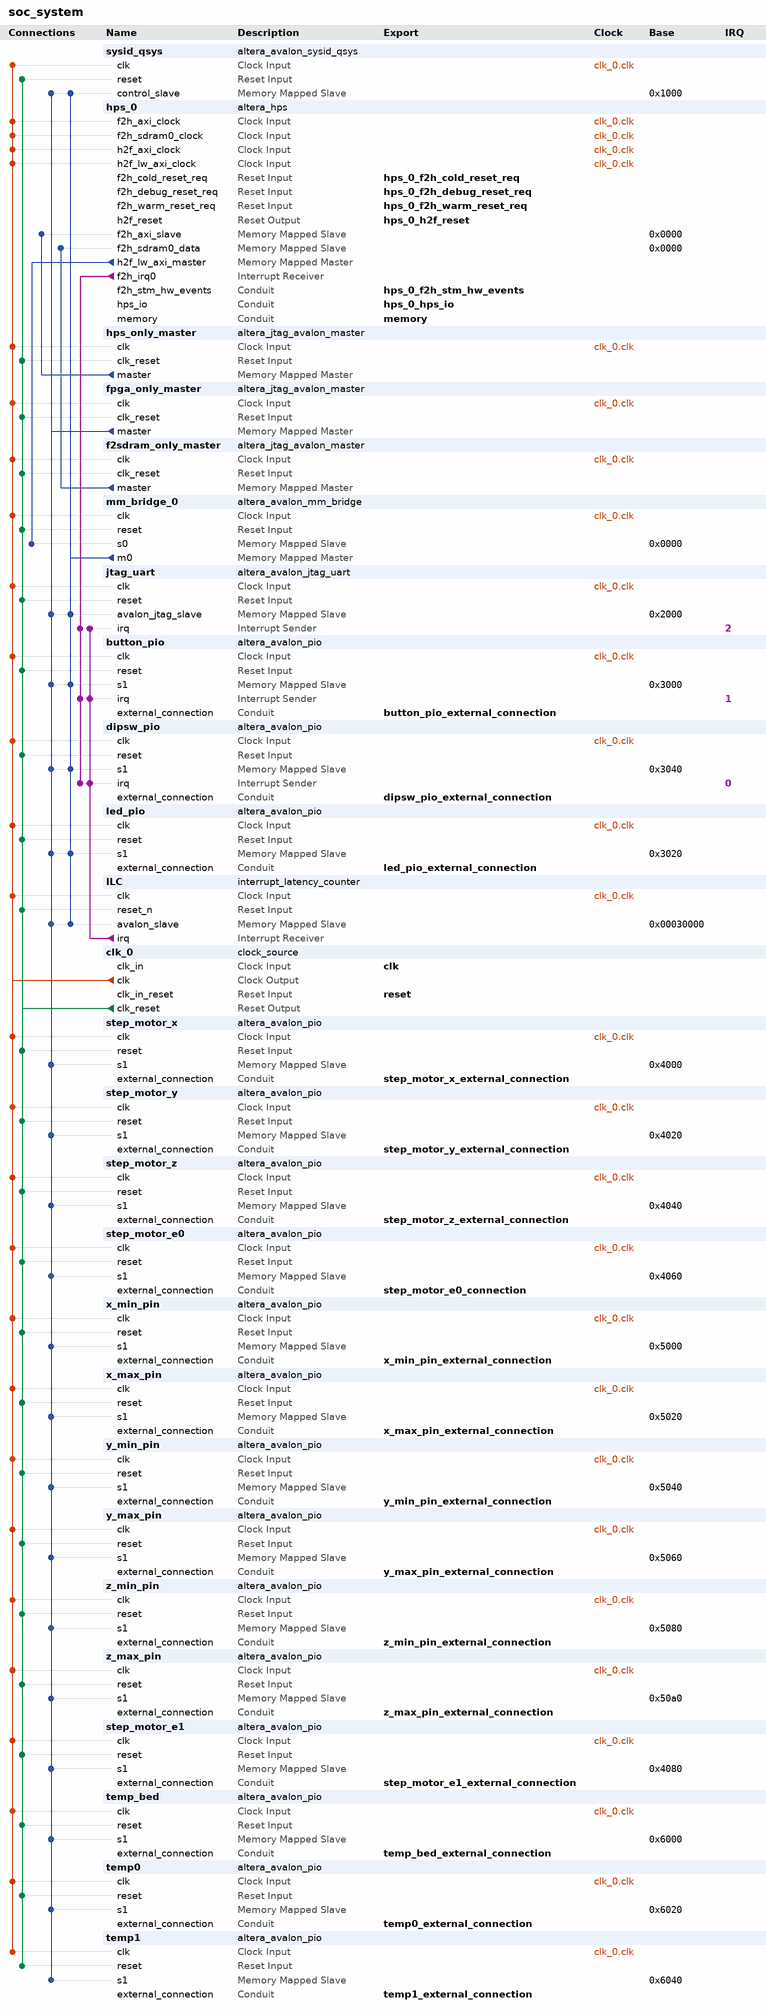
[diagram p0: system contents]
# Platform Designer (Qsys) system soc_system, Cyclone V 5CSEBA6U23I7
# Parameters at their usual value, and those the tool derives, are not listed.
package require -exact qsys 18.1
create_system soc_system
set_project_property DEVICE_FAMILY {Cyclone V}
set_project_property DEVICE 5CSEBA6U23I7

add_instance sysid_qsys altera_avalon_sysid_qsys 18.1
set_instance_parameter_value sysid_qsys id -60670

add_instance hps_0 altera_hps 18.1
set_instance_parameter_value hps_0 EMAC1_Mode RGMII
set_instance_parameter_value hps_0 EMAC1_PinMuxing {HPS I/O Set 0}
set_instance_parameter_value hps_0 F2SCLK_COLDRST_Enable true
set_instance_parameter_value hps_0 F2SCLK_DBGRST_Enable true
set_instance_parameter_value hps_0 F2SCLK_WARMRST_Enable true
set_instance_parameter_value hps_0 F2SDRAM_Type {Avalon-MM Bidirectional}
set_instance_parameter_value hps_0 F2SDRAM_Width 256
set_instance_parameter_value hps_0 F2SINTERRUPT_Enable true
set_instance_parameter_value hps_0 F2S_Width 2
set_instance_parameter_value hps_0 FPGA_PERIPHERAL_OUTPUT_CLOCK_FREQ_EMAC0_GTX_CLK 100
set_instance_parameter_value hps_0 FPGA_PERIPHERAL_OUTPUT_CLOCK_FREQ_EMAC0_MD_CLK 100.0
set_instance_parameter_value hps_0 FPGA_PERIPHERAL_OUTPUT_CLOCK_FREQ_EMAC1_GTX_CLK 100
set_instance_parameter_value hps_0 FPGA_PERIPHERAL_OUTPUT_CLOCK_FREQ_EMAC1_MD_CLK 100.0
set_instance_parameter_value hps_0 HPS_PROTOCOL DDR3
set_instance_parameter_value hps_0 I2C0_Mode I2C
set_instance_parameter_value hps_0 I2C0_PinMuxing {HPS I/O Set 0}
set_instance_parameter_value hps_0 I2C1_Mode I2C
set_instance_parameter_value hps_0 I2C1_PinMuxing {HPS I/O Set 0}
set_instance_parameter_value hps_0 LWH2F_Enable true
set_instance_parameter_value hps_0 MEM_BANKADDR_WIDTH 3
set_instance_parameter_value hps_0 MEM_CLK_FREQ 400.0
set_instance_parameter_value hps_0 MEM_COL_ADDR_WIDTH 10
set_instance_parameter_value hps_0 MEM_DQ_WIDTH 32
set_instance_parameter_value hps_0 MEM_DRV_STR RZQ/6
set_instance_parameter_value hps_0 MEM_ROW_ADDR_WIDTH 15
set_instance_parameter_value hps_0 MEM_RTT_NOM RZQ/6
set_instance_parameter_value hps_0 MEM_RTT_WR {Dynamic ODT off}
set_instance_parameter_value hps_0 MEM_TCL 7
set_instance_parameter_value hps_0 MEM_TFAW_NS 37.5
set_instance_parameter_value hps_0 MEM_TRAS_NS 35.0
set_instance_parameter_value hps_0 MEM_TRCD_NS 13.75
set_instance_parameter_value hps_0 MEM_TRFC_NS 300.0
set_instance_parameter_value hps_0 MEM_TRP_NS 13.75
set_instance_parameter_value hps_0 MEM_VENDOR Other
set_instance_parameter_value hps_0 MEM_WTCL 7
set_instance_parameter_value hps_0 QSPI_Mode N/A
set_instance_parameter_value hps_0 QSPI_PinMuxing Unused
set_instance_parameter_value hps_0 REF_CLK_FREQ 25.0
set_instance_parameter_value hps_0 S2FCLK_USER2CLK 4
set_instance_parameter_value hps_0 S2F_Width 2
set_instance_parameter_value hps_0 SDIO_Mode {4-bit Data}
set_instance_parameter_value hps_0 SDIO_PinMuxing {HPS I/O Set 0}
set_instance_parameter_value hps_0 SPIM1_Mode {Single Slave Select}
set_instance_parameter_value hps_0 SPIM1_PinMuxing {HPS I/O Set 0}
set_instance_parameter_value hps_0 STM_Enable true
set_instance_parameter_value hps_0 TIMING_BOARD_AC_SKEW 0.02
set_instance_parameter_value hps_0 TIMING_BOARD_AC_TO_CK_SKEW 0.0
set_instance_parameter_value hps_0 TIMING_BOARD_DQ_TO_DQS_SKEW 0.0
set_instance_parameter_value hps_0 TIMING_BOARD_MAX_CK_DELAY 0.6
set_instance_parameter_value hps_0 TIMING_BOARD_MAX_DQS_DELAY 0.6
set_instance_parameter_value hps_0 TIMING_BOARD_SKEW_BETWEEN_DQS 0.02
set_instance_parameter_value hps_0 TIMING_BOARD_SKEW_CKDQS_DIMM_MAX 0.01
set_instance_parameter_value hps_0 TIMING_BOARD_SKEW_CKDQS_DIMM_MIN -0.01
set_instance_parameter_value hps_0 TIMING_BOARD_SKEW_WITHIN_DQS 0.02
set_instance_parameter_value hps_0 TIMING_TDH 125
set_instance_parameter_value hps_0 TIMING_TDQSCK 400
set_instance_parameter_value hps_0 TIMING_TDQSQ 120
set_instance_parameter_value hps_0 TIMING_TDS 50
set_instance_parameter_value hps_0 TIMING_TIH 250
set_instance_parameter_value hps_0 TIMING_TIS 175
set_instance_parameter_value hps_0 TIMING_TQSH 0.38
set_instance_parameter_value hps_0 UART0_Mode {No Flow Control}
set_instance_parameter_value hps_0 UART0_PinMuxing {HPS I/O Set 0}
set_instance_parameter_value hps_0 USB1_Mode SDR
set_instance_parameter_value hps_0 USB1_PinMuxing {HPS I/O Set 0}
set_instance_parameter_value hps_0 desired_cfg_clk_mhz 100.0
set_instance_parameter_value hps_0 desired_qspi_clk_mhz 370.0

add_instance hps_only_master altera_jtag_avalon_master 18.1

add_instance fpga_only_master altera_jtag_avalon_master 18.1

add_instance f2sdram_only_master altera_jtag_avalon_master 18.1

add_instance mm_bridge_0 altera_avalon_mm_bridge 18.1
set_instance_parameter_value mm_bridge_0 ADDRESS_UNITS SYMBOLS
set_instance_parameter_value mm_bridge_0 ADDRESS_WIDTH 10
set_instance_parameter_value mm_bridge_0 DATA_WIDTH 32
set_instance_parameter_value mm_bridge_0 MAX_PENDING_RESPONSES 4
set_instance_parameter_value mm_bridge_0 USE_AUTO_ADDRESS_WIDTH 1

add_instance jtag_uart altera_avalon_jtag_uart 18.1
set_instance_parameter_value jtag_uart allowMultipleConnections true
set_instance_parameter_value jtag_uart simInteractiveOptions INTERACTIVE_ASCII_OUTPUT

add_instance button_pio altera_avalon_pio 18.1
set_instance_parameter_value button_pio bitClearingEdgeCapReg true
set_instance_parameter_value button_pio captureEdge true
set_instance_parameter_value button_pio direction Input
set_instance_parameter_value button_pio edgeType FALLING
set_instance_parameter_value button_pio generateIRQ true
set_instance_parameter_value button_pio irqType EDGE
set_instance_parameter_value button_pio width 2

add_instance dipsw_pio altera_avalon_pio 18.1
set_instance_parameter_value dipsw_pio bitClearingEdgeCapReg true
set_instance_parameter_value dipsw_pio captureEdge true
set_instance_parameter_value dipsw_pio direction Input
set_instance_parameter_value dipsw_pio edgeType ANY
set_instance_parameter_value dipsw_pio generateIRQ true
set_instance_parameter_value dipsw_pio irqType EDGE
set_instance_parameter_value dipsw_pio width 4

add_instance led_pio altera_avalon_pio 18.1
set_instance_parameter_value led_pio direction Output
set_instance_parameter_value led_pio resetValue 127
set_instance_parameter_value led_pio width 7

add_instance ILC interrupt_latency_counter 18.1

add_instance clk_0 clock_source 18.1
set_instance_parameter_value clk_0 clockFrequency 50000000

add_instance step_motor_x altera_avalon_pio 18.1
set_instance_parameter_value step_motor_x direction Output
set_instance_parameter_value step_motor_x width 3

add_instance step_motor_y altera_avalon_pio 18.1
set_instance_parameter_value step_motor_y direction Output
set_instance_parameter_value step_motor_y width 3

add_instance step_motor_z altera_avalon_pio 18.1
set_instance_parameter_value step_motor_z direction Output
set_instance_parameter_value step_motor_z width 3

add_instance step_motor_e0 altera_avalon_pio 18.1
set_instance_parameter_value step_motor_e0 direction Output
set_instance_parameter_value step_motor_e0 width 3

add_instance x_min_pin altera_avalon_pio 18.1
set_instance_parameter_value x_min_pin direction Output
set_instance_parameter_value x_min_pin width 1

add_instance x_max_pin altera_avalon_pio 18.1
set_instance_parameter_value x_max_pin direction Output
set_instance_parameter_value x_max_pin width 1

add_instance y_min_pin altera_avalon_pio 18.1
set_instance_parameter_value y_min_pin direction Output
set_instance_parameter_value y_min_pin width 1

add_instance y_max_pin altera_avalon_pio 18.1
set_instance_parameter_value y_max_pin direction Output
set_instance_parameter_value y_max_pin width 1

add_instance z_min_pin altera_avalon_pio 18.1
set_instance_parameter_value z_min_pin direction Output
set_instance_parameter_value z_min_pin width 1

add_instance z_max_pin altera_avalon_pio 18.1
set_instance_parameter_value z_max_pin direction Output
set_instance_parameter_value z_max_pin width 1

add_instance step_motor_e1 altera_avalon_pio 18.1
set_instance_parameter_value step_motor_e1 direction Output
set_instance_parameter_value step_motor_e1 width 3

add_instance temp_bed altera_avalon_pio 18.1
set_instance_parameter_value temp_bed direction Output
set_instance_parameter_value temp_bed width 8

add_instance temp0 altera_avalon_pio 18.1
set_instance_parameter_value temp0 direction Output
set_instance_parameter_value temp0 width 8

add_instance temp1 altera_avalon_pio 18.1
set_instance_parameter_value temp1 direction Output
set_instance_parameter_value temp1 width 8

# connections
add_connection clk_0.clk button_pio.clk clock
add_connection clk_0.clk dipsw_pio.clk clock
add_connection clk_0.clk f2sdram_only_master.clk clock
add_connection clk_0.clk fpga_only_master.clk clock
add_connection clk_0.clk hps_0.f2h_axi_clock clock
add_connection clk_0.clk hps_0.f2h_sdram0_clock clock
add_connection clk_0.clk hps_0.h2f_axi_clock clock
add_connection clk_0.clk hps_0.h2f_lw_axi_clock clock
add_connection clk_0.clk hps_only_master.clk clock
add_connection clk_0.clk ILC.clk clock
add_connection clk_0.clk jtag_uart.clk clock
add_connection clk_0.clk led_pio.clk clock
add_connection clk_0.clk mm_bridge_0.clk clock
add_connection clk_0.clk step_motor_e0.clk clock
add_connection clk_0.clk step_motor_e1.clk clock
add_connection clk_0.clk step_motor_x.clk clock
add_connection clk_0.clk step_motor_y.clk clock
add_connection clk_0.clk step_motor_z.clk clock
add_connection clk_0.clk sysid_qsys.clk clock
add_connection clk_0.clk temp0.clk clock
add_connection clk_0.clk temp1.clk clock
add_connection clk_0.clk temp_bed.clk clock
add_connection clk_0.clk x_max_pin.clk clock
add_connection clk_0.clk x_min_pin.clk clock
add_connection clk_0.clk y_max_pin.clk clock
add_connection clk_0.clk y_min_pin.clk clock
add_connection clk_0.clk z_max_pin.clk clock
add_connection clk_0.clk z_min_pin.clk clock
add_connection clk_0.clk_reset button_pio.reset reset
add_connection clk_0.clk_reset dipsw_pio.reset reset
add_connection clk_0.clk_reset f2sdram_only_master.clk_reset reset
add_connection clk_0.clk_reset fpga_only_master.clk_reset reset
add_connection clk_0.clk_reset hps_only_master.clk_reset reset
add_connection clk_0.clk_reset ILC.reset_n reset
add_connection clk_0.clk_reset jtag_uart.reset reset
add_connection clk_0.clk_reset led_pio.reset reset
add_connection clk_0.clk_reset mm_bridge_0.reset reset
add_connection clk_0.clk_reset step_motor_e0.reset reset
add_connection clk_0.clk_reset step_motor_e1.reset reset
add_connection clk_0.clk_reset step_motor_x.reset reset
add_connection clk_0.clk_reset step_motor_y.reset reset
add_connection clk_0.clk_reset step_motor_z.reset reset
add_connection clk_0.clk_reset sysid_qsys.reset reset
add_connection clk_0.clk_reset temp0.reset reset
add_connection clk_0.clk_reset temp1.reset reset
add_connection clk_0.clk_reset temp_bed.reset reset
add_connection clk_0.clk_reset x_max_pin.reset reset
add_connection clk_0.clk_reset x_min_pin.reset reset
add_connection clk_0.clk_reset y_max_pin.reset reset
add_connection clk_0.clk_reset y_min_pin.reset reset
add_connection clk_0.clk_reset z_max_pin.reset reset
add_connection clk_0.clk_reset z_min_pin.reset reset
add_connection f2sdram_only_master.master hps_0.f2h_sdram0_data avalon
set_connection_parameter_value f2sdram_only_master.master/hps_0.f2h_sdram0_data baseAddress 0x0000
add_connection fpga_only_master.master button_pio.s1 avalon
set_connection_parameter_value fpga_only_master.master/button_pio.s1 baseAddress 0x3000
add_connection fpga_only_master.master dipsw_pio.s1 avalon
set_connection_parameter_value fpga_only_master.master/dipsw_pio.s1 baseAddress 0x3040
add_connection fpga_only_master.master ILC.avalon_slave avalon
set_connection_parameter_value fpga_only_master.master/ILC.avalon_slave baseAddress 0x00030000
add_connection fpga_only_master.master jtag_uart.avalon_jtag_slave avalon
set_connection_parameter_value fpga_only_master.master/jtag_uart.avalon_jtag_slave baseAddress 0x2000
add_connection fpga_only_master.master led_pio.s1 avalon
set_connection_parameter_value fpga_only_master.master/led_pio.s1 baseAddress 0x3020
add_connection fpga_only_master.master step_motor_e0.s1 avalon
set_connection_parameter_value fpga_only_master.master/step_motor_e0.s1 baseAddress 0x4060
add_connection fpga_only_master.master step_motor_e1.s1 avalon
set_connection_parameter_value fpga_only_master.master/step_motor_e1.s1 baseAddress 0x4080
add_connection fpga_only_master.master step_motor_x.s1 avalon
set_connection_parameter_value fpga_only_master.master/step_motor_x.s1 baseAddress 0x4000
add_connection fpga_only_master.master step_motor_y.s1 avalon
set_connection_parameter_value fpga_only_master.master/step_motor_y.s1 baseAddress 0x4020
add_connection fpga_only_master.master step_motor_z.s1 avalon
set_connection_parameter_value fpga_only_master.master/step_motor_z.s1 baseAddress 0x4040
add_connection fpga_only_master.master sysid_qsys.control_slave avalon
set_connection_parameter_value fpga_only_master.master/sysid_qsys.control_slave baseAddress 0x1000
add_connection fpga_only_master.master temp0.s1 avalon
set_connection_parameter_value fpga_only_master.master/temp0.s1 baseAddress 0x6020
add_connection fpga_only_master.master temp1.s1 avalon
set_connection_parameter_value fpga_only_master.master/temp1.s1 baseAddress 0x6040
add_connection fpga_only_master.master temp_bed.s1 avalon
set_connection_parameter_value fpga_only_master.master/temp_bed.s1 baseAddress 0x6000
add_connection fpga_only_master.master x_max_pin.s1 avalon
set_connection_parameter_value fpga_only_master.master/x_max_pin.s1 baseAddress 0x5020
add_connection fpga_only_master.master x_min_pin.s1 avalon
set_connection_parameter_value fpga_only_master.master/x_min_pin.s1 baseAddress 0x5000
add_connection fpga_only_master.master y_max_pin.s1 avalon
set_connection_parameter_value fpga_only_master.master/y_max_pin.s1 baseAddress 0x5060
add_connection fpga_only_master.master y_min_pin.s1 avalon
set_connection_parameter_value fpga_only_master.master/y_min_pin.s1 baseAddress 0x5040
add_connection fpga_only_master.master z_max_pin.s1 avalon
set_connection_parameter_value fpga_only_master.master/z_max_pin.s1 baseAddress 0x50a0
add_connection fpga_only_master.master z_min_pin.s1 avalon
set_connection_parameter_value fpga_only_master.master/z_min_pin.s1 baseAddress 0x5080
add_connection hps_0.h2f_lw_axi_master mm_bridge_0.s0 avalon
set_connection_parameter_value hps_0.h2f_lw_axi_master/mm_bridge_0.s0 baseAddress 0x0000
add_connection hps_only_master.master hps_0.f2h_axi_slave avalon
set_connection_parameter_value hps_only_master.master/hps_0.f2h_axi_slave baseAddress 0x0000
add_connection mm_bridge_0.m0 button_pio.s1 avalon
set_connection_parameter_value mm_bridge_0.m0/button_pio.s1 baseAddress 0x3000
add_connection mm_bridge_0.m0 dipsw_pio.s1 avalon
set_connection_parameter_value mm_bridge_0.m0/dipsw_pio.s1 baseAddress 0x3040
add_connection mm_bridge_0.m0 ILC.avalon_slave avalon
set_connection_parameter_value mm_bridge_0.m0/ILC.avalon_slave baseAddress 0x00030000
add_connection mm_bridge_0.m0 jtag_uart.avalon_jtag_slave avalon
set_connection_parameter_value mm_bridge_0.m0/jtag_uart.avalon_jtag_slave baseAddress 0x2000
add_connection mm_bridge_0.m0 led_pio.s1 avalon
set_connection_parameter_value mm_bridge_0.m0/led_pio.s1 baseAddress 0x3020
add_connection mm_bridge_0.m0 sysid_qsys.control_slave avalon
set_connection_parameter_value mm_bridge_0.m0/sysid_qsys.control_slave baseAddress 0x1000
add_connection hps_0.f2h_irq0 button_pio.irq interrupt
set_connection_parameter_value hps_0.f2h_irq0/button_pio.irq irqNumber 1
add_connection hps_0.f2h_irq0 dipsw_pio.irq interrupt
set_connection_parameter_value hps_0.f2h_irq0/dipsw_pio.irq irqNumber 0
add_connection hps_0.f2h_irq0 jtag_uart.irq interrupt
set_connection_parameter_value hps_0.f2h_irq0/jtag_uart.irq irqNumber 2
add_connection ILC.irq button_pio.irq interrupt
set_connection_parameter_value ILC.irq/button_pio.irq irqNumber 1
add_connection ILC.irq dipsw_pio.irq interrupt
set_connection_parameter_value ILC.irq/dipsw_pio.irq irqNumber 0
add_connection ILC.irq jtag_uart.irq interrupt
set_connection_parameter_value ILC.irq/jtag_uart.irq irqNumber 2

# exported interfaces
add_interface button_pio_external_connection conduit end
set_interface_property button_pio_external_connection EXPORT_OF button_pio.external_connection
add_interface clk clock sink
set_interface_property clk EXPORT_OF clk_0.clk_in
add_interface dipsw_pio_external_connection conduit end
set_interface_property dipsw_pio_external_connection EXPORT_OF dipsw_pio.external_connection
add_interface hps_0_f2h_cold_reset_req reset sink
set_interface_property hps_0_f2h_cold_reset_req EXPORT_OF hps_0.f2h_cold_reset_req
add_interface hps_0_f2h_debug_reset_req reset sink
set_interface_property hps_0_f2h_debug_reset_req EXPORT_OF hps_0.f2h_debug_reset_req
add_interface hps_0_f2h_stm_hw_events conduit end
set_interface_property hps_0_f2h_stm_hw_events EXPORT_OF hps_0.f2h_stm_hw_events
add_interface hps_0_f2h_warm_reset_req reset sink
set_interface_property hps_0_f2h_warm_reset_req EXPORT_OF hps_0.f2h_warm_reset_req
add_interface hps_0_h2f_reset reset source
set_interface_property hps_0_h2f_reset EXPORT_OF hps_0.h2f_reset
add_interface hps_0_hps_io conduit end
set_interface_property hps_0_hps_io EXPORT_OF hps_0.hps_io
add_interface led_pio_external_connection conduit end
set_interface_property led_pio_external_connection EXPORT_OF led_pio.external_connection
add_interface memory conduit end
set_interface_property memory EXPORT_OF hps_0.memory
add_interface reset reset sink
set_interface_property reset EXPORT_OF clk_0.clk_in_reset
add_interface step_motor_e0_connection conduit end
set_interface_property step_motor_e0_connection EXPORT_OF step_motor_e0.external_connection
add_interface step_motor_e1_external_connection conduit end
set_interface_property step_motor_e1_external_connection EXPORT_OF step_motor_e1.external_connection
add_interface step_motor_x_external_connection conduit end
set_interface_property step_motor_x_external_connection EXPORT_OF step_motor_x.external_connection
add_interface step_motor_y_external_connection conduit end
set_interface_property step_motor_y_external_connection EXPORT_OF step_motor_y.external_connection
add_interface step_motor_z_external_connection conduit end
set_interface_property step_motor_z_external_connection EXPORT_OF step_motor_z.external_connection
add_interface temp0_external_connection conduit end
set_interface_property temp0_external_connection EXPORT_OF temp0.external_connection
add_interface temp1_external_connection conduit end
set_interface_property temp1_external_connection EXPORT_OF temp1.external_connection
add_interface temp_bed_external_connection conduit end
set_interface_property temp_bed_external_connection EXPORT_OF temp_bed.external_connection
add_interface x_max_pin_external_connection conduit end
set_interface_property x_max_pin_external_connection EXPORT_OF x_max_pin.external_connection
add_interface x_min_pin_external_connection conduit end
set_interface_property x_min_pin_external_connection EXPORT_OF x_min_pin.external_connection
add_interface y_max_pin_external_connection conduit end
set_interface_property y_max_pin_external_connection EXPORT_OF y_max_pin.external_connection
add_interface y_min_pin_external_connection conduit end
set_interface_property y_min_pin_external_connection EXPORT_OF y_min_pin.external_connection
add_interface z_max_pin_external_connection conduit end
set_interface_property z_max_pin_external_connection EXPORT_OF z_max_pin.external_connection
add_interface z_min_pin_external_connection conduit end
set_interface_property z_min_pin_external_connection EXPORT_OF z_min_pin.external_connection

set_interconnect_requirement {$system} qsys_mm.clockCrossingAdapter HANDSHAKE
set_interconnect_requirement {$system} qsys_mm.maxAdditionalLatency 1

save_system soc_system.qsys
